# EAGLE design Platienen schalplan Backup#2 (EAGLE 9.3.0)
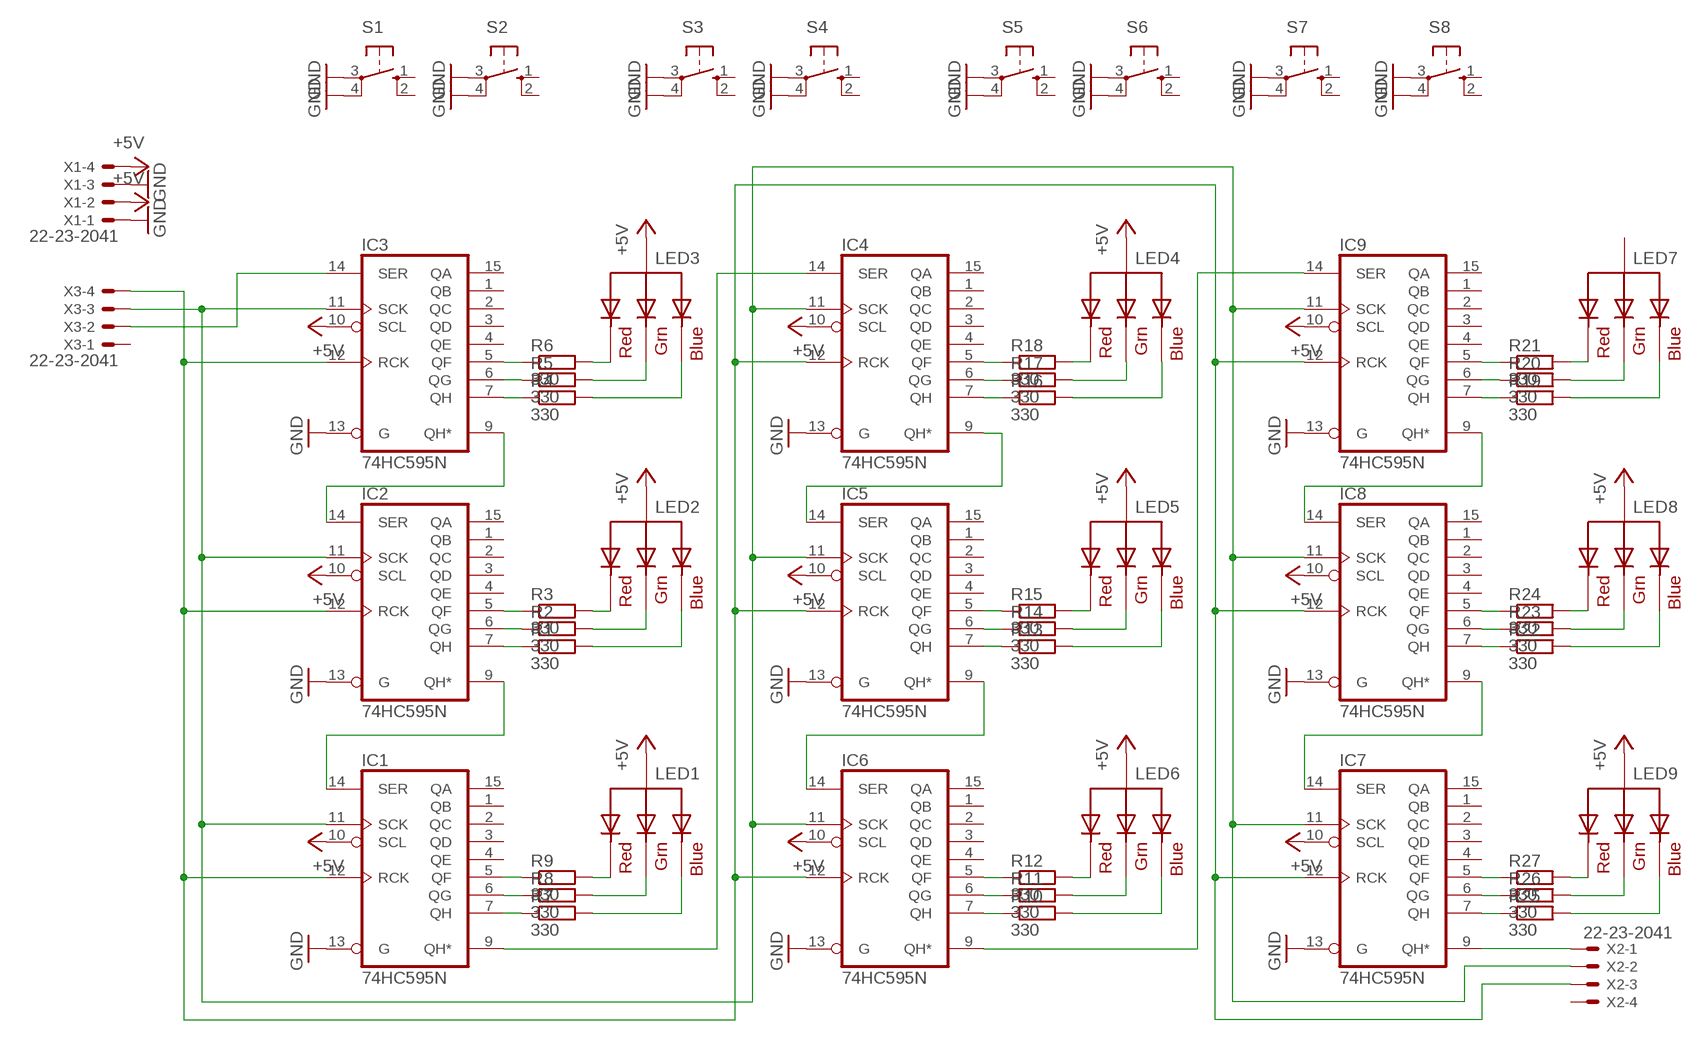
[diagram p0: schematic, sheet 1]

## Parts
IC1  74HC595N  [DIL16]
IC2  74HC595N  [DIL16]
IC3  74HC595N  [DIL16]
IC4  74HC595N  [DIL16]
IC5  74HC595N  [DIL16]
IC6  74HC595N  [DIL16]
IC7  74HC595N  [DIL16]
IC8  74HC595N  [DIL16]
IC9  74HC595N  [DIL16]
LED1  RGBLED_CA-5MM  [LED5MMRGB]
LED2  RGBLED_CA-5MM  [LED5MMRGB]
LED3  RGBLED_CA-5MM  [LED5MMRGB]
LED4  RGBLED_CA-5MM  [LED5MMRGB]
LED5  RGBLED_CA-5MM  [LED5MMRGB]
LED6  RGBLED_CA-5MM  [LED5MMRGB]
LED7  RGBLED_CA-5MM  [LED5MMRGB]
LED8  RGBLED_CA-5MM  [LED5MMRGB]
LED9  RGBLED_CA-5MM  [LED5MMRGB]
R1  330  R-EU_0204/5  [0204/5]
R2  330  R-EU_0204/5  [0204/5]
R3  330  R-EU_0204/5  [0204/5]
R4  330  R-EU_0204/5  [0204/5]
R5  330  R-EU_0204/5  [0204/5]
R6  330  R-EU_0204/5  [0204/5]
R7  330  R-EU_0204/5  [0204/5]
R8  330  R-EU_0204/5  [0204/5]
R9  330  R-EU_0204/5  [0204/5]
R10  330  R-EU_0204/5  [0204/5]
R11  330  R-EU_0204/5  [0204/5]
R12  330  R-EU_0204/5  [0204/5]
R13  330  R-EU_0204/5  [0204/5]
R14  330  R-EU_0204/5  [0204/5]
R15  330  R-EU_0204/5  [0204/5]
R16  330  R-EU_0204/5  [0204/5]
R17  330  R-EU_0204/5  [0204/5]
R18  330  R-EU_0204/5  [0204/5]
R19  330  R-EU_0204/5  [0204/5]
R20  330  R-EU_0204/5  [0204/5]
R21  330  R-EU_0204/5  [0204/5]
R22  330  R-EU_0204/5  [0204/5]
R23  330  R-EU_0204/5  [0204/5]
R24  330  R-EU_0204/5  [0204/5]
R25  330  R-EU_0204/5  [0204/5]
R26  330  R-EU_0204/5  [0204/5]
R27  330  R-EU_0204/5  [0204/5]
S1  10-XX  [B3F-10XX]
S2  10-XX  [B3F-10XX]
S3  10-XX  [B3F-10XX]
S4  10-XX  [B3F-10XX]
S5  10-XX  [B3F-10XX]
S6  10-XX  [B3F-10XX]
S7  10-XX  [B3F-10XX]
S8  10-XX  [B3F-10XX]
X1  22-23-2041  [22-23-2041]
X2  22-23-2041  [22-23-2041]
X3  22-23-2041  [22-23-2041]

## Nets
+5V: IC1.10(SCL) IC2.10(SCL) IC3.10(SCL) IC4.10(SCL) IC5.10(SCL) IC6.10(SCL) IC7.10(SCL) IC8.10(SCL) IC9.10(SCL) LED1.2(VCC) LED2.2(VCC) LED3.2(VCC) LED4.2(VCC) LED5.2(VCC) LED6.2(VCC) LED8.2(VCC) LED9.2(VCC) X1.2 X1.4
GND: IC1.13(G) IC2.13(G) IC3.13(G) IC4.13(G) IC5.13(G) IC6.13(G) IC7.13(G) IC8.13(G) IC9.13(G) S1.3(P) S1.4(P1) S2.3(P) S2.4(P1) S3.3(P) S3.4(P1) S4.3(P) S4.4(P1) S5.3(P) S5.4(P1) S6.3(P) S6.4(P1) S7.3(P) S7.4(P1) S8.3(P) S8.4(P1) X1.1 X1.3
N$1: IC3.7(QH) R4.1
N$2: IC3.6(QG) R5.1
N$3: IC3.5(QF) R6.1
N$4: LED5.1(RED) R15.2
N$5: LED4.1(RED) R18.2
N$6: LED7.1(RED) R21.2
N$7: IC2.7(QH) R1.1
N$8: IC2.6(QG) R2.1
N$9: IC2.5(QF) R3.1
N$10: IC1.5(QF) R9.1
N$11: IC1.6(QG) R8.1
N$12: IC1.7(QH) R7.1
N$13: LED7.3(GREEN) R20.2
N$14: LED7.4(BLUE) R19.2
N$15: LED8.1(RED) R24.2
N$16: LED8.3(GREEN) R23.2
N$17: LED8.4(BLUE) R22.2
N$18: LED9.1(RED) R27.2
N$19: IC6.7(QH) R10.1
N$20: IC6.6(QG) R11.1
N$21: IC6.5(QF) R12.1
N$22: LED9.3(GREEN) R26.2
N$23: LED9.4(BLUE) R25.2
N$24: LED6.1(RED) R12.2
N$25: IC5.7(QH) R13.1
N$26: IC5.6(QG) R14.1
N$27: IC5.5(QF) R15.1
N$28: LED6.3(GREEN) R11.2
N$29: LED6.4(BLUE) R10.2
N$30: LED5.3(GREEN) R14.2
N$31: IC4.7(QH) R16.1
N$32: IC4.6(QG) R17.1
N$33: IC4.5(QF) R18.1
N$34: LED5.4(BLUE) R13.2
N$35: LED4.3(GREEN) R17.2
N$36: LED4.4(BLUE) R16.2
N$37: IC9.7(QH) R19.1
N$38: IC9.6(QG) R20.1
N$39: IC9.5(QF) R21.1
N$40: IC8.5(QF) R24.1
N$41: IC8.6(QG) R23.1
N$42: IC8.7(QH) R22.1
N$43: IC7.5(QF) R27.1
N$44: IC7.6(QG) R26.1
N$45: IC7.7(QH) R25.1
N$47: LED2.1(RED) R3.2
N$48: LED2.3(GREEN) R2.2
N$49: LED2.4(BLUE) R1.2
N$50: LED1.1(RED) R9.2
N$51: LED1.3(GREEN) R8.2
N$52: LED1.4(BLUE) R7.2
N$53: LED3.1(RED) R6.2
N$54: LED3.3(GREEN) R5.2
N$55: IC2.14(SER) IC3.9(QH*)
N$56: IC1.14(SER) IC2.9(QH*)
N$57: IC1.9(QH*) IC4.14(SER)
N$58: IC4.9(QH*) IC5.14(SER)
N$59: IC5.9(QH*) IC6.14(SER)
N$60: IC6.9(QH*) IC9.14(SER)
N$61: IC8.14(SER) IC9.9(QH*)
N$62: IC7.14(SER) IC8.9(QH*)
N$63: IC1.12(RCK) IC2.12(RCK) IC3.12(RCK) IC4.12(RCK) IC5.12(RCK) IC6.12(RCK) IC7.12(RCK) IC8.12(RCK) IC9.12(RCK) X2.3 X3.4
N$64: IC3.14(SER) X3.2
N$65: IC1.11(SCK) IC2.11(SCK) IC3.11(SCK) IC4.11(SCK) IC5.11(SCK) IC6.11(SCK) IC7.11(SCK) IC8.11(SCK) IC9.11(SCK) X2.2 X3.3
N$66: IC7.9(QH*) X2.1
N$67: LED3.4(BLUE) R4.2
Unconnected: IC1.1(QB) IC1.2(QC) IC1.3(QD) IC1.4(QE) IC1.15(QA) IC2.1(QB) IC2.2(QC) IC2.3(QD) IC2.4(QE) IC2.15(QA) IC3.1(QB) IC3.2(QC) IC3.3(QD) IC3.4(QE) IC3.15(QA) IC4.1(QB) IC4.2(QC) IC4.3(QD) IC4.4(QE) IC4.15(QA) IC5.1(QB) IC5.2(QC) IC5.3(QD) IC5.4(QE) IC5.15(QA) IC6.1(QB) IC6.2(QC) IC6.3(QD) IC6.4(QE) IC6.15(QA) IC7.1(QB) IC7.2(QC) IC7.3(QD) IC7.4(QE) IC7.15(QA) IC8.1(QB) IC8.2(QC) IC8.3(QD) IC8.4(QE) IC8.15(QA) IC9.1(QB) IC9.2(QC) IC9.3(QD) IC9.4(QE) IC9.15(QA) LED7.2(VCC) S1.1(S) S1.2(S1) S2.1(S) S2.2(S1) S3.1(S) S3.2(S1) S4.1(S) S4.2(S1) S5.1(S) S5.2(S1) S6.1(S) S6.2(S1) S7.1(S) S7.2(S1) S8.1(S) S8.2(S1) X2.4 X3.1

## Power pins joined to a net without a drawn wire
GND: IC1.8(GND) IC2.8(GND) IC3.8(GND) IC4.8(GND) IC5.8(GND) IC6.8(GND) IC7.8(GND) IC8.8(GND) IC9.8(GND)
VCC: IC1.16(VCC) IC2.16(VCC) IC3.16(VCC) IC4.16(VCC) IC5.16(VCC) IC6.16(VCC) IC7.16(VCC) IC8.16(VCC) IC9.16(VCC)

## Library data of the parts
IC1-IC9 = 74xx-eu:74*595: 8-bit SHIFT REGISTER, output latch
LED1-LED9 = adafruit:RGBLED_CA: RGB LED, common-anode 5MM Staggered pins 5mm Piranha package http://www.ladyada.net/library/pcb/eaglelibrary.html
R1-R27 = rcl:R-EU_: RESISTOR, European symbol; SPICEPREFIX: R
S1-S8 = switch-omron:10-XX: OMRON SWITCH; MPN: B3F-1000; OC_FARNELL: 176432; OC_NEWARK: 36M3542
X1-X3 = con-molex:22-23-2041: .100" (2.54mm) Center Header - 4 Pin; MF: MOLEX; MPN: 22-23-2041; OC_FARNELL: 1462920; OC_NEWARK: 38C0355

## Board
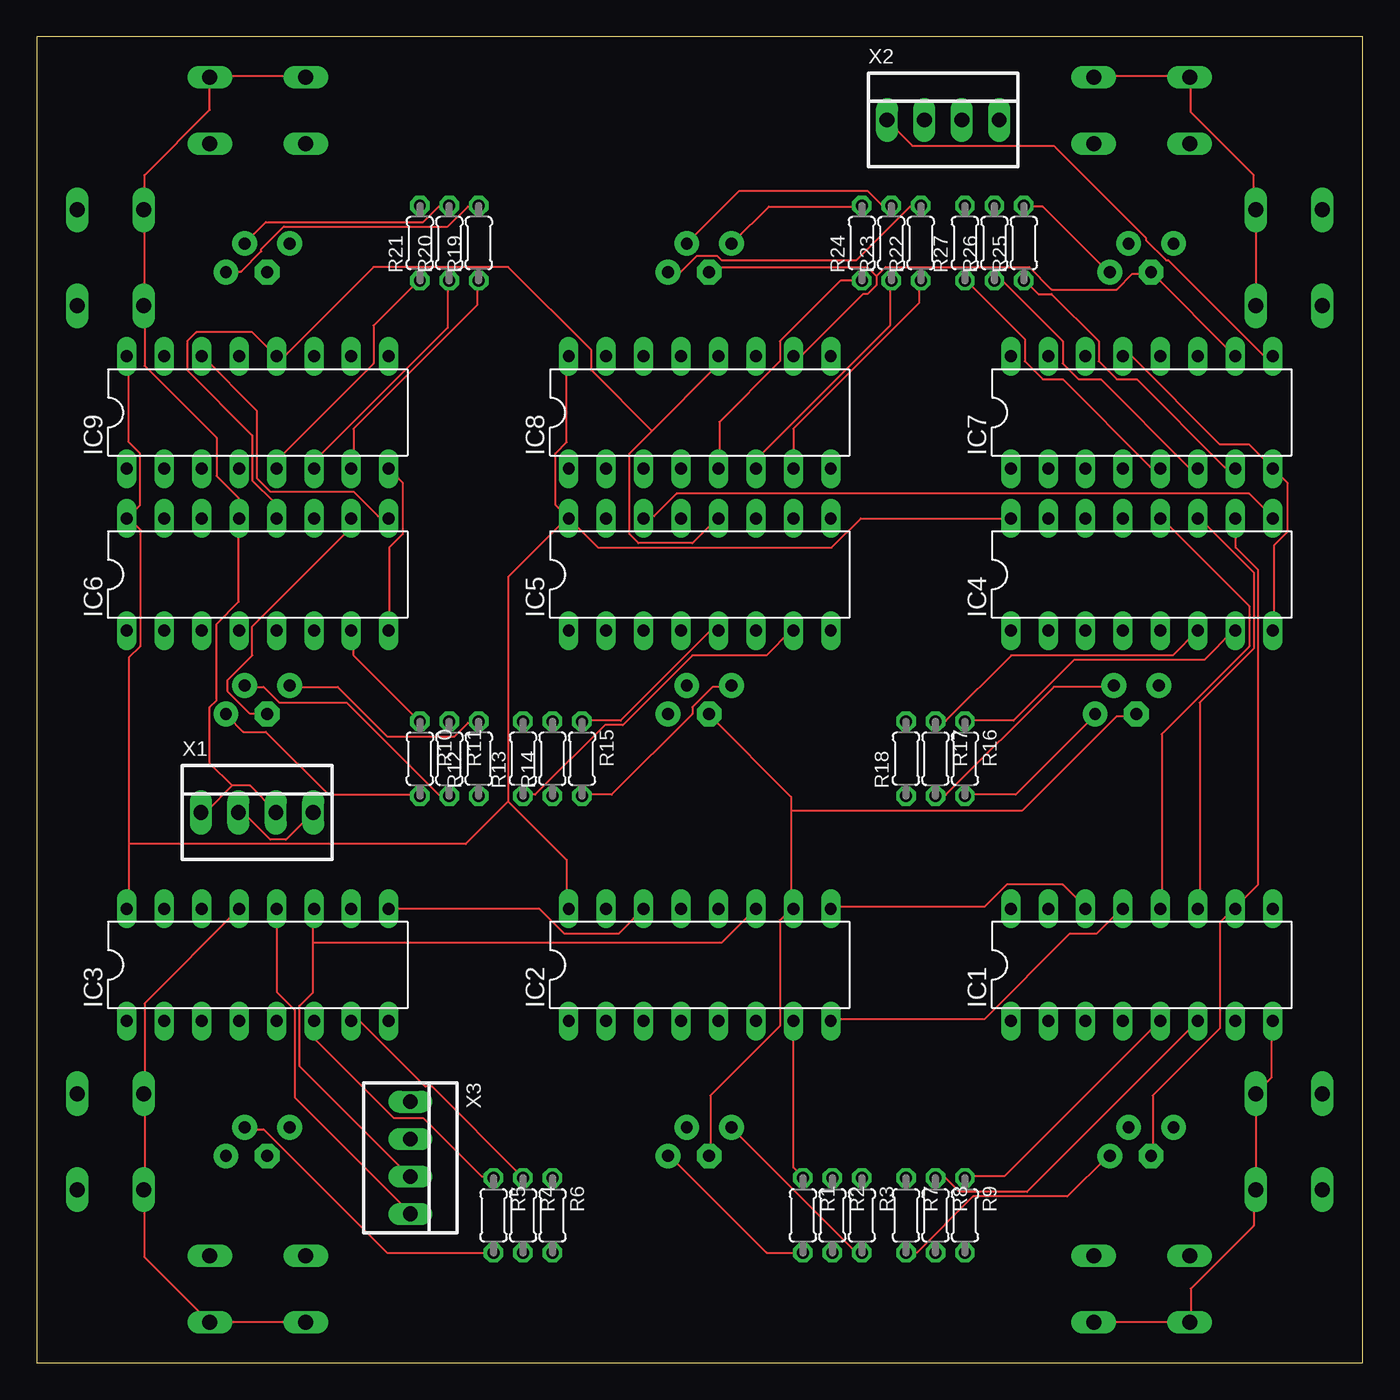
[diagram p1: board, top side]
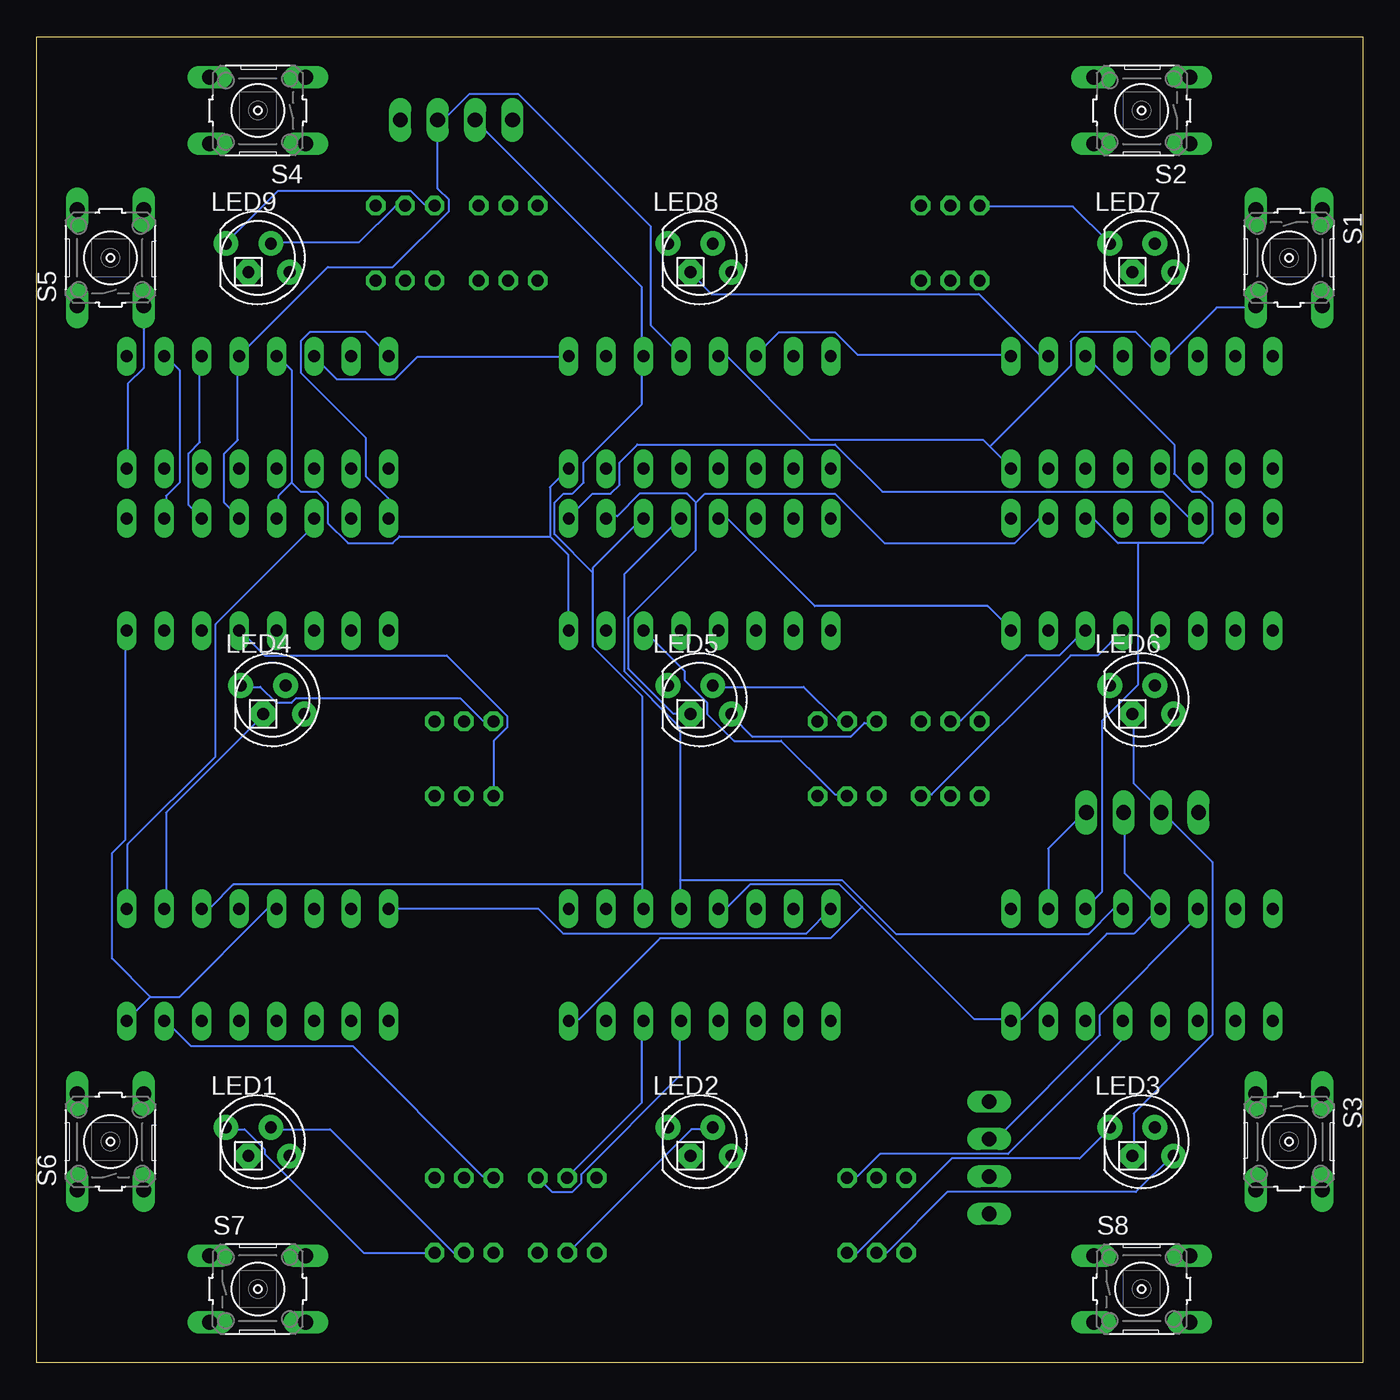
[diagram p2: board, bottom side, seen from below]

Size 90 x 90 mm. Coordinates in mm from the lower left corner, seen from the top.
Outline: 0,0 90,0 90,90 0,90 0,0
Copper layers (1*16): Top 0.035mm / dielectric 1.5mm / Bottom 0.035mm
Design rules "default": minimum track width 6mil, minimum drill 0.35mm, track to track 6mil, track to pad 6mil, pad to pad 6mil, via to via 6mil, smd to smd 6mil, copper to edge 40mil, drill to drill 6mil, minimum pad ring 10mil, minimum via ring 8mil, stop-mask expansion 4mil, vias tented up to drill 0mil, thermal gap 10mil

### Footprints (pad centres in the part's own frame; a part is rotated, then mirrored left to right if it is on the bottom)
DIL16 = drill 0.813 long: 1 -8.89,-3.81; 2 -6.35,-3.81; 3 -3.81,-3.81; 4 -1.27,-3.81; 5 1.27,-3.81; 6 3.81,-3.81; 7 6.35,-3.81; 8 8.89,-3.81; 9 8.89,3.81; 10 6.35,3.81; 11 3.81,3.81; 12 1.27,3.81; 13 -1.27,3.81; 14 -3.81,3.81; 15 -6.35,3.81; 16 -8.89,3.81
LED5MMRGB = drill 0.8 pad 1.676: 1 -2.159,0.968; 3 0.889,0.968; 4 2.159,-0.968 | drill 0.8 pad 1.676 octagon: 2 -0.635,-0.968
0204/5 = drill 0.813 octagon: 1 -2.54,0; 2 2.54,0
B3F-10XX = drill 1.016 long: 1 -3.251,2.261; 2 3.251,2.261; 3 -3.251,-2.261; 4 3.251,-2.261
22-23-2041 = drill 1 long: 1 -3.81,0; 2 -1.27,0; 3 1.27,0; 4 3.81,0

### Placement (x,y rotation side)
IC1  75,27 0 top
IC2  45,27 0 top
IC3  15,27 0 top
IC4  75,53.5 0 top
IC5  45,53.5 0 top
IC6  15,53.5 0 top
IC7  75,64.5 0 top
IC8  45,64.5 0 top
IC9  15,64.5 0 top
LED1  75,15 0 bottom
LED2  45,15 0 bottom
LED3  15,15 0 bottom
LED4  74,45 0 bottom
LED5  45,45 0 bottom
LED6  15,45 0 bottom
LED7  15,75 0 bottom
LED8  45,75 0 bottom
LED9  75,75 0 bottom
R1  52,10 270 top
R2  54,10 270 top
R3  56,10 270 top
R4  33,10 270 top
R5  31,10 270 top
R6  35,10 270 top
R7  59,10 270 top
R8  61,10 270 top
R9  63,10 270 top
R10  26,41 270 top
R11  28,41 270 top
R12  30,41 90 top
R13  33,41 90 top
R14  35,41 90 top
R15  37,41 270 top
R16  63,41 270 top
R17  61,41 270 top
R18  59,41 90 top
R19  30,76 90 top
R20  28,76 90 top
R21  26,76 90 top
R22  60,76 90 top
R23  58,76 90 top
R24  56,76 90 top
R25  67,76 90 top
R26  65,76 90 top
R27  63,76 90 top
S1  5,75 270 bottom
S2  15,85 180 bottom
S3  5,15 270 bottom
S4  75,85 180 bottom
S5  85,75 90 bottom
S6  85,15 90 bottom
S7  75,5 0 bottom
S8  15,5 0 bottom
X1  14.95,37.35 0 top
X2  61.52,84.35 0 top
X3  25.35,13.91 270 top

### Tracks (layer width: path | path; a pad name or v marks a point on that pad's centre or on a via)
+5V
  Top 0.152: IC7.10 81.23,68.43 75.74,73.91 LED9.2 75.59,73.91 74.37,73.91 73.3,72.85 68.89,72.85 67.36,74.37 57.61,74.37 57,73.76 | 57,73.76 57,73.15 56.39,72.54 56.08,72.54 51.97,68.43 51.36,68.43 IC8.10 | 57,73.76 56.39,74.37 46.02,74.37 45.72,74.07 LED8.2 | IC6.10 21.34,57.3 21.34,56.69 14.63,49.99 14.63,48.01 12.95,46.33 12.95,45.57 14.48,44.04 15.54,44.04 LED6.2 | X1.2 13.72,37.34 14.02,37.34 15.85,35.51 16.92,35.51 18.75,37.34 X1.4 | LED1.2 75.74,14.17 75.74,18.14 80.31,22.71 80.31,29.87 81.23,30.79 IC1.10 81.38,30.94 82.91,32.46 82.91,53.8 81.38,55.32 81.38,57.3 IC4.10 | 51.21,37.49 51.21,38.41 45.72,43.89 LED5.2 | 51.21,37.49 51.21,30.94 IC2.10 51.21,30.79 50.44,30.02 50.44,22.86 45.72,18.14 45.72,14.17 LED2.2 | 51.21,37.49 66.9,37.49 73.3,43.89 74.52,43.89 LED4.2
  Bottom 0.152: IC4.10 81.23,57.45 81.23,58.83 80.31,59.74 80.31,67.36 81.23,68.28 IC7.10 | IC9.10 21.49,68.43 21.95,68.43 26.06,72.54 44.2,72.54 45.57,73.91 LED8.2 | IC3.10 21.34,30.94 21.34,34.9 18.9,37.34 X1.4 | LED3.2 15.54,14.17 15.54,16.92 10.21,22.25 10.21,33.98 13.56,37.34 X1.2 13.72,37.49 15.54,39.32 15.54,43.89 LED6.2 | IC1.10 81.23,30.94 81.23,37.34 74.68,43.89 LED4.2 | 45.26,58.37 45.87,58.98 49.07,58.98 50.6,57.45 51.21,57.45 IC5.10 | 45.26,58.37 45.26,55.17 49.84,50.6 49.84,47.09 46.79,44.04 45.72,44.04 LED5.2 | 45.26,58.37 44.65,58.98 35.81,58.98 32.46,55.63 23.62,55.63 21.95,57.3 21.49,57.3 IC6.10
GND
  Top 0.152: IC6.8 23.93,49.84 23.93,55.32 24.84,56.24 24.84,59.74 23.93,60.66 IC9.8 | S2.4 18.14,87.33 11.89,87.33 S2.3 11.73,87.17 11.73,85.04 7.32,80.62 7.32,78.33 S1.3 7.32,78.18 7.32,71.78 S1.4 7.32,71.63 7.32,67.67 12.19,62.79 12.19,60.2 13.72,58.67 13.72,57.45 IC6.13 13.72,57.3 13.72,51.66 12.19,50.14 12.19,44.96 11.73,44.5 11.73,40.69 13.26,39.17 | IC4.8 83.97,49.84 83.97,55.47 84.89,56.39 84.89,59.74 83.97,60.66 IC7.8 83.82,60.81 82.3,62.33 80.31,62.33 74.37,68.28 73.76,68.28 IC7.13 | S4.3 71.78,87.33 78.18,87.33 S4.4 78.33,87.17 78.33,84.89 82.6,80.62 82.6,78.33 S5.4 82.75,78.18 82.75,71.78 S5.3 | IC2.8 53.95,23.32 64.31,23.32 70.1,29.11 71.93,29.11 73.61,30.79 IC1.13 | S7.4 71.78,2.74 78.18,2.74 S7.3 78.33,2.74 78.33,5.03 82.6,9.3 82.6,11.73 S6.3 82.75,11.89 82.75,18.14 S6.4 82.75,18.29 83.82,19.36 83.82,23.16 IC1.8 | S8.3 18.14,2.74 11.89,2.74 S8.4 11.73,2.74 7.32,7.16 7.32,11.73 S3.4 7.32,11.89 7.32,18.14 S3.3 7.32,18.29 7.32,24.38 13.72,30.79 IC3.13 | 13.26,39.17 11.58,37.49 11.28,37.49 X1.1 | 13.26,39.17 14.48,39.17 16.15,37.49 X1.3
  Bottom 0.152: IC5.13 43.59,57.3 43.13,57.3 37.19,51.36 25.45,51.36 23.93,49.84 IC6.8 | 25.3,62.18 23.93,60.81 IC9.8 | 25.3,62.18 25.76,62.64 37.49,62.64 43.13,68.28 43.59,68.28 IC8.13 | S1.4 7.32,71.63 9.91,71.63 13.11,68.43 13.72,68.43 IC9.13 13.87,68.43 15.39,69.95 19.2,69.95 19.81,69.34 19.81,67.67 25.3,62.18 | 55.17,56.08 53.95,54.86 53.95,49.84 IC5.8 | 55.17,56.08 55.17,59.44 53.95,60.66 IC8.8 | 72.69,59.74 73.61,58.83 73.61,57.45 IC4.13 | 72.69,59.74 72.69,67.36 73.61,68.28 IC7.13 | 55.17,56.08 65.38,56.08 65.84,55.63 68.89,55.63 70.26,57 70.26,58.37 71.02,59.13 72.08,59.13 72.69,59.74 | IC7.8 83.82,60.81 83.82,66.45 82.75,67.51 82.75,71.63 S5.3 | 82.3,24.84 80.31,24.84 74.37,30.79 73.76,30.79 IC1.13 | 82.3,24.84 83.82,23.32 IC1.8 | 33.98,30.94 26.36,23.32 23.93,23.32 IC3.8 23.77,23.32 23.16,23.32 17.37,29.11 15.54,29.11 13.87,30.79 IC3.13 13.87,30.94 16.15,33.22 16.15,37.34 X1.3 | 33.98,30.94 35.51,32.46 41.6,32.46 43.13,30.94 43.59,30.94 IC2.13 | 33.98,30.94 36.12,28.8 47.7,28.8 53.19,23.32 53.8,23.32 IC2.8 | 82.3,24.84 84.89,27.43 84.89,34.59 83.97,35.51 83.97,49.68 IC4.8
N$1
  Top 0.152: IC3.7 21.49,23.16 21.95,23.16 26.36,18.75 26.82,18.75 32.92,12.65 R4.1
N$2
  Top 0.152: R5.1 30.94,12.65 30.18,12.65 26.21,16.61 24.23,16.61 18.9,21.95 18.9,23.16 IC3.6
N$3
  Bottom 0.152: R6.1 34.9,12.65 34.29,12.65 32.77,14.17 24.08,14.17 16.31,21.95 16.31,23.16 IC3.5
N$4
  Top 0.152: R15.2 37.03,38.56 39.01,38.56 44.5,44.04 44.5,44.5 45.87,45.87 47.09,45.87 LED5.1
N$5
  Bottom 0.152: R18.2 59.13,43.59 59.74,43.59 61.27,45.11 72.39,45.11 72.69,44.81 73.76,44.81 74.83,45.87 76.05,45.87 LED4.1
N$6
  Bottom 0.152: R21.2 25.91,78.49 19.66,78.49 17.22,76.05 LED7.1
N$7
  Top 0.152: IC2.7 51.36,23.16 51.36,13.26 51.97,12.65 R1.1
N$8
  Bottom 0.152: IC2.6 48.92,23.16 48.92,17.68 53.95,12.65 R2.1
N$9
  Bottom 0.152: IC2.5 46.33,23.16 46.33,19.51 53.03,12.8 53.03,12.19 53.65,11.58 55.02,11.58 55.93,12.5 R3.1
N$10
  Top 0.152: R9.1 63.09,12.65 65.68,12.65 76.2,23.16 IC1.5
N$11
  Top 0.152: R8.1 61.11,12.5 61.72,12.5 62.64,11.58 67.21,11.58 78.79,23.16 IC1.6
N$12
  Bottom 0.152: R7.1 59.13,12.65 59.74,12.65 68.58,21.49 79.55,21.49 81.23,23.16 IC1.7
N$13
  Top 0.152: R20.2 27.89,78.49 27.28,78.49 26.21,77.42 15.54,77.42 14.17,76.05 LED7.3
N$14
  Top 0.152: R19.2 29.87,78.49 29.26,78.49 27.89,77.11 16.76,77.11 15.24,75.59 15.24,75.44 13.87,74.07 12.95,74.07 LED7.4
N$15
  Top 0.152: R24.2 55.93,78.49 49.68,78.49 47.24,76.05 LED8.1
N$16
  Top 0.152: R23.2 57.91,78.64 57.3,78.64 56.39,79.55 47.7,79.55 44.2,76.05 LED8.3
N$17
  Top 0.152: R22.2 59.89,78.49 59.28,78.49 55.63,74.83 46.48,74.83 46.18,75.13 44.81,75.13 43.74,74.07 42.98,74.07 LED8.4
N$18
  Bottom 0.152: R27.2 63.09,78.64 63.7,78.64 64.62,79.55 73.61,79.55 77.11,76.05 LED9.1
N$19
  Top 0.152: IC6.7 21.49,49.68 21.49,48.01 25.91,43.59 R10.1
N$20
  Bottom 0.152: R11.1 27.89,43.59 27.28,43.59 22.86,48.01 20.57,48.01 18.9,49.68 IC6.6
N$21
  Bottom 0.152: R12.1 29.87,38.56 29.26,38.56 19.81,48.01 17.98,48.01 16.31,49.68 IC6.5
N$22
  Bottom 0.152: R26.2 65.08,78.49 65.68,78.49 68.12,76.05 74.07,76.05 LED9.3
N$23
  Top 0.152: R25.2 67.06,78.49 68.28,78.49 72.69,74.07 LED9.4
N$24
  Top 0.152: R12.2 29.87,43.43 29.26,43.43 28.35,42.52 23.77,42.52 20.42,45.87 17.22,45.87 LED6.1
N$25
  Top 0.152: R13.1 33.07,38.56 33.83,38.56 38.56,43.28 39.78,43.28 44.5,48.01 49.53,48.01 51.21,49.68 IC5.7
N$26
  Bottom 0.152: R14.1 35.05,38.56 35.81,38.56 39.47,42.22 42.67,42.22 44.5,44.04 44.5,44.81 46.02,46.33 46.02,46.94 48.77,49.68 IC5.6
N$27
  Top 0.152: R15.1 37.03,43.59 39.62,43.59 45.72,49.68 46.18,49.68 IC5.5
N$28
  Top 0.152: R11.2 27.89,38.56 27.28,38.56 21.03,44.81 16.46,44.81 15.39,45.87 14.17,45.87 LED6.3
N$29
  Top 0.152: R10.2 25.91,38.56 19.81,38.56 15.54,42.82 14.02,42.82 12.95,43.89 LED6.4
N$30
  Bottom 0.152: R14.2 35.05,43.59 35.66,43.59 37.95,45.87 44.04,45.87 LED5.3
N$31
  Top 0.152: R16.1 63.09,43.59 66.29,43.59 70.41,47.7 79.25,47.7 81.23,49.68 IC4.7
N$32
  Top 0.152: R17.1 61.11,43.59 61.72,43.59 66.14,48.01 77.11,48.01 78.79,49.68 IC4.6
N$33
  Bottom 0.152: R18.1 58.98,38.56 58.98,42.22 58.06,43.13 58.06,43.89 62.18,48.01 74.52,48.01 76.2,49.68 IC4.5
N$34
  Bottom 0.152: R13.2 33.07,43.43 33.83,43.43 34.75,42.52 41.45,42.52 42.82,43.89 LED5.4
N$35
  Top 0.152: R17.2 61.11,38.56 61.72,38.56 69.04,45.87 73,45.87 LED4.3
N$36
  Top 0.152: R16.2 63.09,38.56 66.45,38.56 71.78,43.89 LED4.4
N$37
  Top 0.152: IC9.7 21.49,60.81 21.49,63.4 29.87,71.78 29.87,73.46 R19.1
N$38
  Top 0.152: IC9.6 18.9,60.81 18.9,61.27 27.89,70.26 27.89,73.46 R20.1
N$39
  Top 0.152: IC9.5 16.31,60.81 16.31,61.27 22.86,67.82 22.86,70.41 25.91,73.46 R21.1
N$40
  Top 0.152: IC8.5 46.33,60.81 46.33,63.86 50.44,67.97 50.44,69.34 54.56,73.46 55.93,73.46 R24.1
N$41
  Top 0.152: IC8.6 48.92,60.81 48.92,61.42 57.91,70.41 57.91,73.46 R23.1
N$42
  Top 0.152: IC8.7 51.36,60.81 51.36,63.4 59.89,71.93 59.89,73.46 R22.1
N$43
  Top 0.152: IC7.5 76.2,60.81 75.59,60.81 69.65,66.75 68.28,66.75 67.06,67.97 67.06,69.49 63.09,73.46 R27.1
N$44
  Top 0.152: IC7.6 78.79,60.81 78.18,60.81 72.24,66.75 70.71,66.75 69.65,67.82 69.65,69.34 65.53,73.46 65.08,73.46 R26.1
N$45
  Top 0.152: IC7.7 81.23,60.81 80.62,60.81 74.68,66.75 73.3,66.75 72.08,67.97 72.08,69.34 68.89,72.54 67.97,72.54 67.06,73.46 R25.1
N$47
  Top 0.152: R3.2 55.93,7.47 55.63,7.47 47.24,15.85 LED2.1
N$48
  Bottom 0.152: R2.2 53.95,7.47 45.57,15.85 44.2,15.85 LED2.3
N$49
  Top 0.152: R1.2 51.97,7.47 49.53,7.47 42.98,14.02 LED2.4
N$50
  Bottom 0.152: R9.2 63.09,7.47 67.82,7.47 74.52,14.17 74.52,14.48 75.89,15.85 77.11,15.85 LED1.1
N$51
  Bottom 0.152: R8.2 61.11,7.47 61.72,7.47 70.1,15.85 74.07,15.85 LED1.3
N$52
  Top 0.152: R7.2 59.13,7.47 59.74,7.47 63.55,11.28 69.95,11.28 72.69,14.02 LED1.4
N$53
  Bottom 0.152: R6.2 34.9,7.47 34.29,7.47 27.89,13.87 19.2,13.87 17.22,15.85 LED3.1
N$54
  Top 0.152: R5.2 30.94,7.47 23.77,7.47 15.39,15.85 14.17,15.85 LED3.3
N$55
  Top 0.152: IC3.9 23.93,30.79 34.14,30.79 35.81,29.11 39.47,29.11 41.15,30.79 IC2.14
N$56
  Top 0.152: IC2.9 53.95,30.94 64.31,30.94 65.84,32.46 69.65,32.46 71.17,30.94 IC1.14
N$57
  Bottom 0.152: IC4.14 71.32,57.3 71.32,56.69 77.88,50.14 77.88,41.15 83.82,35.2 83.82,30.94 IC1.9
N$58
  Top 0.152: IC5.14 41.3,57.45 41.91,57.45 43.43,58.98 82.3,58.98 83.82,57.45 IC4.9
N$59
  Bottom 0.152: IC6.14 11.28,57.45 11.89,57.45 13.56,59.13 32.61,59.13 35.81,62.33 49.23,62.33 50.44,61.11 50.44,59.59 51.05,58.98 52.27,58.98 53.8,57.45 IC5.9
N$60
  Top 0.152: IC6.9 23.77,57.45 23.16,57.45 21.49,59.13 15.85,59.13 14.94,60.05 14.94,64.62 11.28,68.28 IC9.14
N$61
  Bottom 0.152: IC9.9 23.93,68.43 34.29,68.43 35.81,69.95 39.62,69.95 41.15,68.43 IC8.14
N$62
  Bottom 0.152: IC8.9 53.95,68.28 64.16,68.28 65.68,66.75 69.65,66.75 71.17,68.28 IC7.14
N$63
  Top 0.152: IC1.12 76.35,30.94 76.35,42.67 82.3,48.62 82.3,51.36 76.35,57.3 IC4.12 | IC3.12 16.31,30.79 16.31,25.15 17.53,23.93 17.53,17.98 25.3,10.21 X3.4 | IC6.12 16.15,57.45 16.15,58.37 14.63,59.89 14.63,62.94 10.21,67.36 10.21,69.34 10.82,69.95 14.63,69.95 16.15,68.43 IC9.12 16.31,68.43 16.92,68.43 22.86,74.37 32,74.37 37.64,68.73 37.64,67.36 41.76,63.25 | 41.76,63.25 40.23,61.72 40.23,56.24 40.84,55.63 44.5,55.63 46.18,57.3 IC5.12 | 41.76,63.25 46.18,67.67 46.18,68.28 IC8.12
  Bottom 0.152: IC4.12 76.35,57.45 77.27,58.37 77.27,61.72 76.35,62.64 76.35,68.28 IC7.12 76.2,68.43 70.26,74.37 65.84,74.37 62.03,78.18 62.03,78.94 62.79,79.7 62.79,84.28 X2.3 62.79,84.43 62.33,84.43 60.66,86.11 57.3,86.11 48.31,77.11 48.31,70.41 46.33,68.43 IC8.12 | 46.33,32.77 46.33,43.13 50.14,46.94 50.14,53.49 46.33,57.3 IC5.12 | 46.33,32.77 46.33,30.94 IC2.12 | 46.33,32.77 35.36,32.77 31.7,29.11 18.59,29.11 16.92,30.79 16.31,30.79 IC3.12
N$64
  Bottom 0.152: IC3.14 11.28,30.79 11.28,30.18 17.83,23.62 17.83,22.25 24.84,15.24 25.3,15.24 X3.2
N$65
  Top 0.152: 18.75,28.5 18.75,25.15 17.83,24.23 17.83,20.12 25.3,12.65 X3.3 | 18.75,28.5 18.75,30.79 IC3.11 | IC1.11 78.94,30.94 78.94,44.81 82.6,48.46 82.6,53.65 78.94,57.3 IC4.11 | 18.75,28.5 46.48,28.5 48.77,30.79 IC2.11
  Bottom 0.152: 15.24,55.63 10.82,55.63 10.21,56.24 10.21,58.37 10.97,59.13 11.58,59.13 12.8,60.35 12.8,62.33 18.75,68.28 IC9.11 | 15.24,55.63 16.61,55.63 18.29,57.3 18.75,57.3 IC6.11 | 15.24,55.63 15.24,46.02 17.68,43.59 17.68,32 18.75,30.94 IC3.11 | IC7.11 78.94,68.28 78.94,62.48 79.7,61.72 79.7,58.22 78.94,57.45 IC4.11 | 48.92,32.46 48.92,45.26 52.27,48.62 52.27,53.65 | 48.92,32.46 48.92,30.94 IC2.11 | 52.27,53.65 52.27,53.95 48.92,57.3 IC5.11 | 52.27,53.65 54.86,56.24 54.86,58.37 54.25,58.98 53.65,58.98 52.88,59.74 52.88,61.11 48.92,65.08 48.92,68.28 IC8.11 48.92,68.43 48.92,73 60.2,84.28 X2.2 | 48.92,32.46 76.66,32.46 78.18,30.94 78.79,30.94 IC1.11
N$66
  Top 0.152: IC7.9 83.82,68.43 83.21,68.43 76.81,74.83 76.66,74.83 75.29,76.2 75.29,76.35 69.04,82.6 59.44,82.6 57.76,84.28 X2.1
N$67
  Bottom 0.152: R4.2 32.92,7.47 32.31,7.47 28.19,11.58 15.39,11.58 12.95,14.02 LED3.4
VCC
  Top 0.152: 6.25,35.2 6.25,47.85 7.01,48.62 7.01,56.54 6.25,57.3 IC6.16 6.25,57.45 7.01,58.22 7.01,61.72 6.25,62.48 6.25,68.28 IC9.16 | 6.25,35.2 6.25,30.94 IC3.16 | 32,38.1 35.97,34.14 35.97,30.94 IC2.16 | 32,38.1 32,53.34 35.97,57.3 IC5.16 | IC8.16 35.97,68.28 35.97,62.48 35.2,61.72 35.2,58.22 35.97,57.45 IC5.16 | IC4.16 65.99,57.3 55.93,57.3 53.95,55.32 38.1,55.32 IC5.16 | 6.25,35.2 29.11,35.2 32,38.1
  Bottom 0.152: IC4.16 66.14,57.45 66.14,58.67 67.67,60.2 67.67,62.79 72.08,67.21 72.08,69.34 71.48,69.95 67.67,69.95 66.14,68.43 IC7.16 | IC1.16 65.99,30.79 55.93,30.79 54.25,29.11 37.8,29.11 36.12,30.79 IC2.16